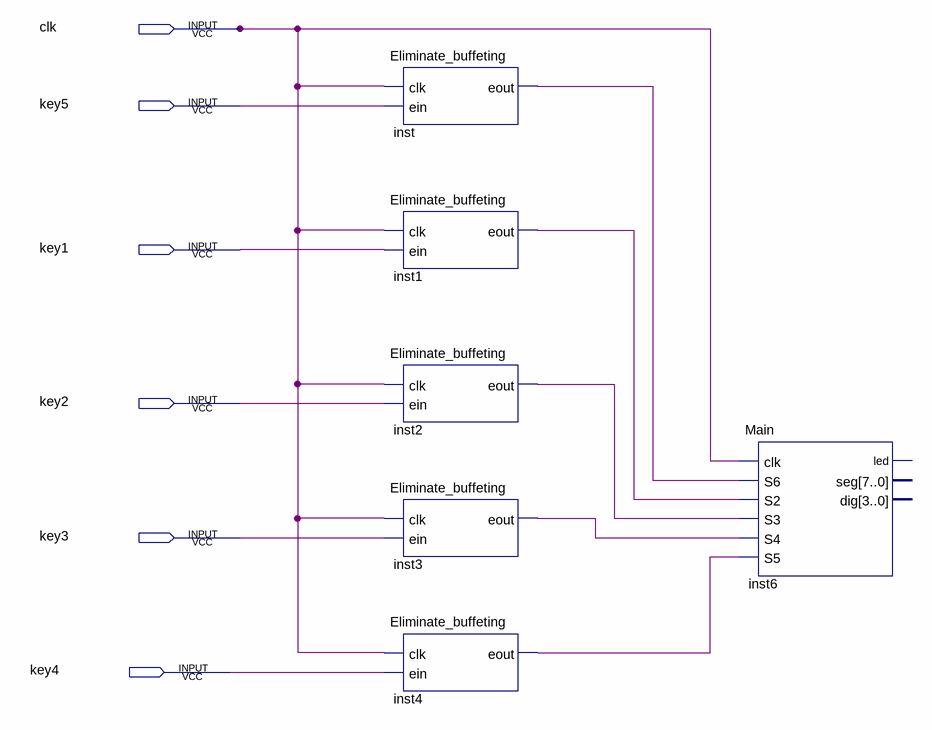
[diagram p0: schematic sheet]
// Quartus schematic Lock.bdf as structural Verilog: 6 symbols, 6 pins
module Lock (
  input  clk,
  input  key5,
  input  key1,
  input  key2,
  input  key3,
  input  key4
);

  wire inst1_eout, inst2_eout, inst3_eout, inst4_eout, inst_eout;

  Eliminate_buffeting inst (.clk(clk), .ein(key5), .eout(inst_eout));
  Eliminate_buffeting inst1 (.clk(clk), .ein(key1), .eout(inst1_eout));
  Eliminate_buffeting inst2 (.clk(clk), .ein(key2), .eout(inst2_eout));
  Eliminate_buffeting inst3 (.clk(clk), .ein(key3), .eout(inst3_eout));
  Eliminate_buffeting inst4 (.clk(clk), .ein(key4), .eout(inst4_eout));
  Main inst6 (
    .clk(clk), .S6(inst_eout), .S2(inst1_eout), .S3(inst2_eout), .S4(inst3_eout), .S5(inst4_eout));  // open: led, seg, dig
endmodule
